# Altium schematic sheet Droneport_with_STM32.SchDoc
size A2; SheetNumber: 1; SheetTotal: 1
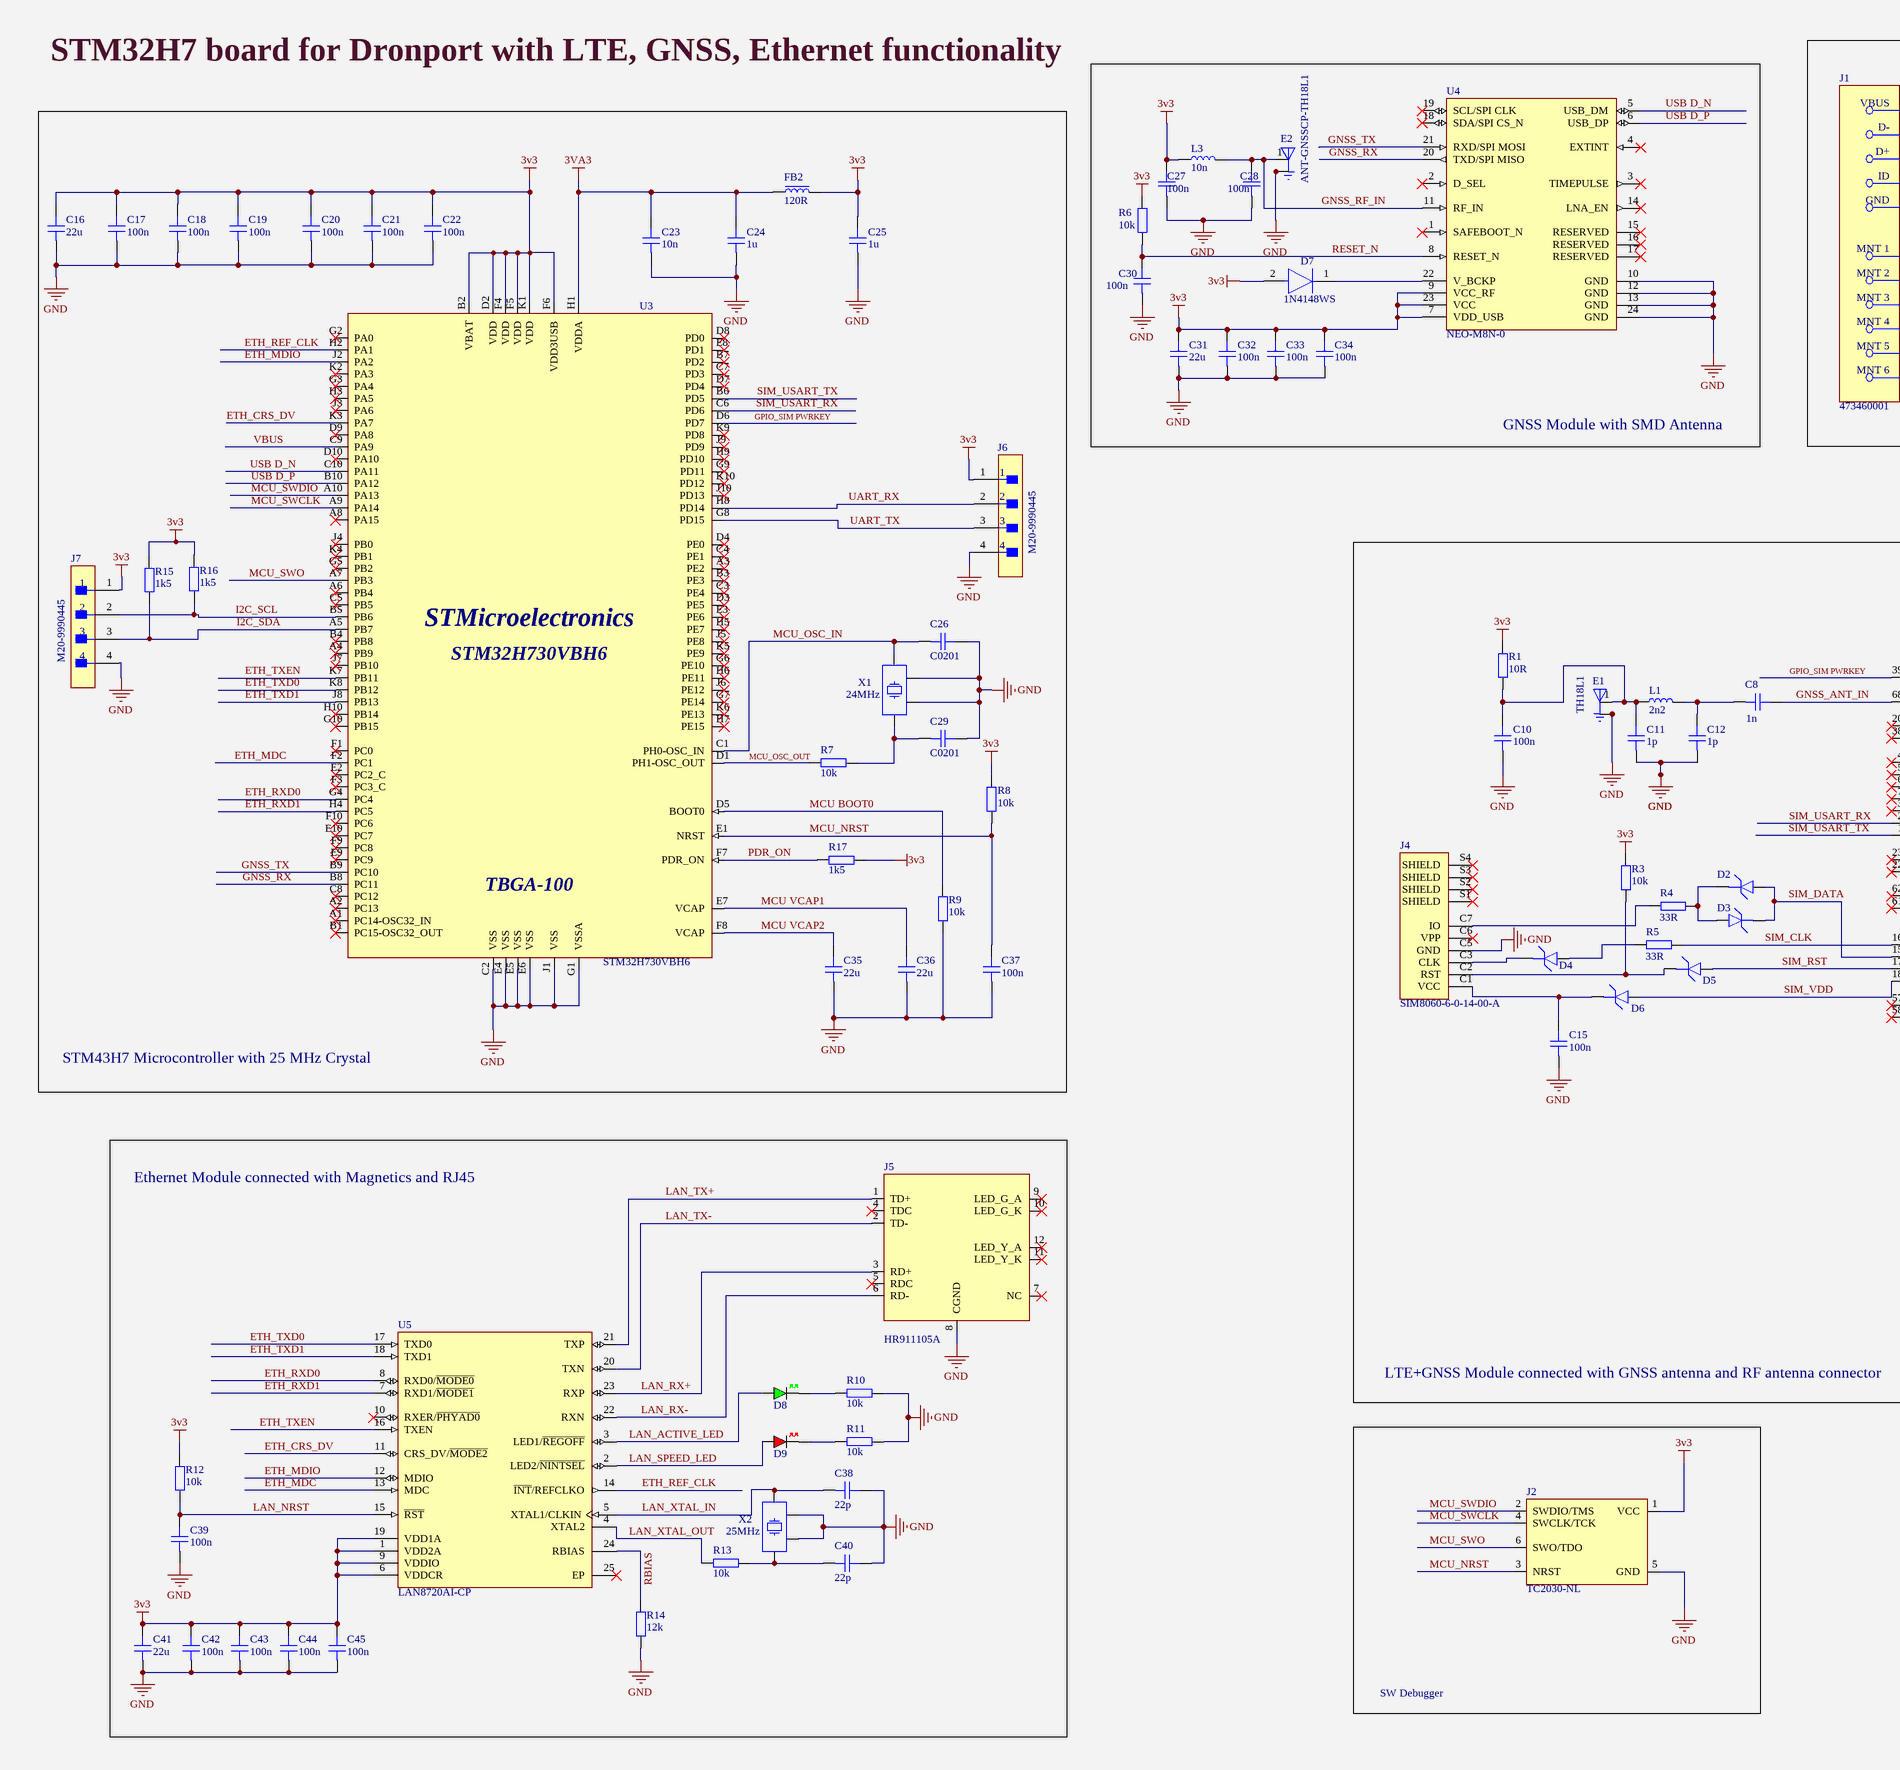
[diagram p0: Droneport_with_STM32.SchDoc, left]
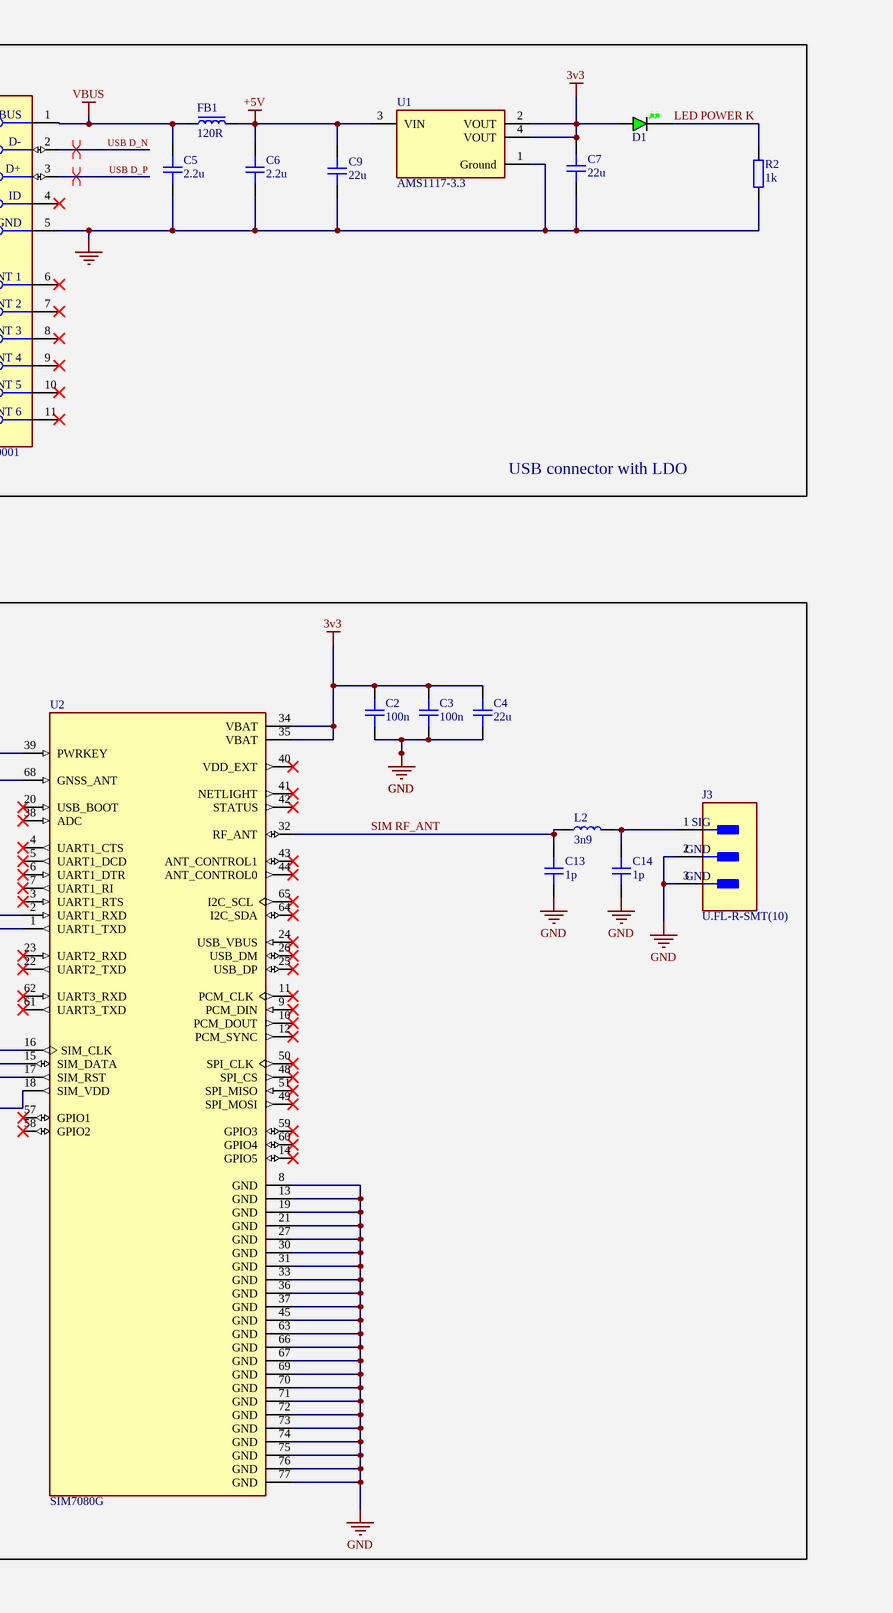
[diagram p1: Droneport_with_STM32.SchDoc, right]

## Parts
C2  100n  [CAP_0402]
C3  100n  [CAP_0402]
C4  22u  [CAP_0603]
C5  2.2u  [CAP_0603]
C6  2.2u  [CAP_0603]
C7  22u  [CAP_0805]
C8  1n  [CAP_0402]
C9  22u  [CAP_0805]
C10  100n  [CAP_0402]
C11  1p  [CAP_0402]
C12  1p  [CAP_0402]
C13  1p  [CAP_0402]
C14  1p  [CAP_0402]
C15  100n  [CAP_0402]
C16  22u  [CAP_0603]
C17  100n  [CAP_0402]
C18  100n  [CAP_0402]
C19  100n  [CAP_0402]
C20  100n  [CAP_0402]
C21  100n  [CAP_0402]
C22  100n  [CAP_0402]
C23  10n  [CAP_0402]
C24  1u  [CAP_0402]
C25  1u  [CAP_0402]
C26  C0201  [CAP_0201]
C27  100n  [CAP_0402]
C28  100n  [CAP_0402]
C29  C0201  [CAP_0201]
C30  100n  [CAP_0402]
C31  22u  [CAP_0603]
C32  100n  [CAP_0402]
C33  100n  [CAP_0402]
C34  100n  [CAP_0402]
C35  22u  [CAP_0805]
C36  22u  [CAP_0805]
C37  100n  [CAP_0402]
C38  22p  [CAP_0402]
C39  100n  [CAP_0402]
C40  22p  [CAP_0402]
C41  22u  [CAP_0603]
C42  100n  [CAP_0402]
C43  100n  [CAP_0402]
C44  100n  [CAP_0402]
C45  100n  [CAP_0402]
D1  GREEN  [LED_0402_GREEN]  (value not drawn)
D2  TVS_DATA  [D_0402]  (value not drawn)
D3  TVS_DATA  [D_0402]  (value not drawn)
D4  TVS_CLK  [D_0402]  (value not drawn)
D5  TVS_RST  [D_0402]  (value not drawn)
D6  TVS_VDD  [D_0402]  (value not drawn)
D7  1N4148WS  [FP-477AB-IPC_C]
D8  GREEN  [LED_0402_GREEN]  (value not drawn)
D9  RED  [LED_0402_RED]  (value not drawn)
E1  TH18L1  [XCVR_ANT-GNSSCP-TH18L1]
E2  ANT-GNSSCP-TH18L1  [XCVR_ANT-GNSSCP-TH18L1]
FB1  120R  [FB_0603]
FB2  120R  [FB_0603]
J1  473460001  [FP-473460001-MFG]
J2  TC2030-NL  [TC2030-NL-FP]  (no BOM)
J3  U.FL-R-SMT(10)  [FP-U_FL-R-SMT_10-MFG]
J4  SIM8060-6-0-14-00-A  [GCT_SIM8060-6-0-14-00-A]
J5  HR911105A  [HR911105A]
J6  M20-9990445  [FP-M20-9990445-MFG]
J7  M20-9990445  [FP-M20-9990445-MFG]
L1  2n2  [IND_0402]
L2  3n9  [IND_0402]
L3  10n  [IND_0603]
R1  10R  [RES_0402]
R2  1k  [RES_0402]
R3  10k  [RES_0402]
R4  33R  [RES_0402]
R5  33R  [RES_0402]
R6  10k  [RES_0402]
R7  10k  [RES_0603]
R8  10k  [RES_0603]
R9  10k  [RES_0603]
R10  10k  [RES_0402]
R11  10k  [RES_0402]
R12  10k  [RES_0402]
R13  10k  [RES_0402]
R14  12k  [RES_0402]
R15  1k5  [RES_0603]
R16  1k5  [RES_0603]
R17  1k5  [RES_0603]
U1  AMS1117-3.3  [FP-AMS1117-IPC_C]
U2  SIM7080G  [XCVR_SIM7080G]
U3  STM32H730VBH6  [TFBGA100_8X8_STM]
U4  NEO-M8N-0  [UBX-NEO-M8-24_V]
U5  LAN8720AI-CP  [MCHP-QFN-24_V]
X1  24MHz  [XTAL_3225]
X2  25MHz  [XTAL_3225]

## Blocks framed on the sheet
USB connector with LDO: C5-C7 C9 D1 FB1 J1 R2 U1
GNSS Module with SMD Antenna: C27 C28 C30-C34 D7 E2 L3 R6 U4
STM43H7 Microcontroller with 25 MHz Crystal: C16-C26 C29 C35-C37 FB2 J6 J7 R7-R9 R15-R17 U3 X1
Ethernet Module connected with Magnetics and RJ45: C38-C45 D8 D9 J5 R10-R14 U5 X2
SW Debugger: J2

## Nets
3v3: C2.2 C3.2 C4.2 C7.2 C16.2 C17.2 C18.2 C19.2 C20.2 C21.2 C22.2 C25.2 C27.2 C31.2 C32.2 C33.2 C34.2 C41.2 C42.2 C43.2 C44.2 C45.2 D1.A D7.2(A) FB2.2 J2.1(VCC) J6.1 J7.1 L3.1 R1.2 R3.2 R6.2 R8.2 R12.1 R15.2 R16.2 R17.1 U1.2(VOUT) U1.4(VOUT) U2.34(VBAT) U2.35(VBAT) U3.B2(VBAT) U3.D2(VDD) U3.F4(VDD) U3.F5(VDD) U3.F6(VDD3USB) U3.K1(VDD) U4.7(VDD_USB) U4.9(VCC_RF) U4.23(VCC) U5.1(VDD2A) U5.6(VDDCR) U5.9(VDDIO) U5.19(VDD1A)
3VA3: C23.2 C24.2 FB2.1 U3.H1(VDDA)
+5V: C6.2 C9.2 FB1.2 U1.3(VIN)
GND: C2.1 C3.1 C4.1 C5.1 C6.1 C7.1 C9.1 C10.1 C11.1 C12.1 C13.1 C14.1 C15.1 C16.1 C17.1 C18.1 C19.1 C20.1 C21.1 C22.1 C23.1 C24.1 C25.1 C26.2 C27.1 C28.1 C29.2 C30.1 C31.1 C32.1 C33.1 C34.1 C35.1 C36.1 C37.1 C38.2 C39.1 C40.2 C41.1 C42.1 C43.1 C44.1 C45.1 E1.2(GND) E1.3(GND) E1.4(GND) E1.5(GND) E2.2(GND) E2.3(GND) E2.4(GND) E2.5(GND) J1.5(GND) J2.5(GND) J3.2(GND) J3.3(GND) J4.C5(GND) J5.8(CGND) J6.4 J7.4 R2.1 R9.1 R10.2 R11.2 R14.1 U1.1(Ground) U2.8(GND) U2.13(GND) U2.19(GND) U2.21(GND) U2.27(GND) U2.30(GND) U2.31(GND) U2.33(GND) U2.36(GND) U2.37(GND) U2.45(GND) U2.63(GND) U2.66(GND) U2.67(GND) U2.69(GND) U2.70(GND) U2.71(GND) U2.72(GND) U2.73(GND) U2.74(GND) U2.75(GND) U2.76(GND) U2.77(GND) U3.C2(VSS) U3.E4(VSS) U3.E5(VSS) U3.E6(VSS) U3.G1(VSSA) U3.J1(VSS) U4.10(GND) U4.12(GND) U4.13(GND) U4.24(GND) X1.2 X1.4 X2.2 X2.4
VBUS: C5.2 FB1.1 J1.1(VBUS) U3.C9(PA9)
ETH_CRS_DV: U3.K3(PA7) U5.11(CRS_DV/~{MODE2})
ETH_MDC: U3.F2(PC1) U5.13(MDC)
ETH_MDIO: U3.J2(PA2) U5.12(MDIO)
ETH_REF_CLK: U3.H2(PA1) U5.14(~{INT}/REFCLKO)
ETH_RXD0: U3.G4(PC4) U5.8(RXD0/~{MODE0})
ETH_RXD1: U3.H4(PC5) U5.7(RXD1/~{MODE1})
ETH_TXD0: U3.K8(PB12) U5.17(TXD0)
ETH_TXD1: U3.J8(PB13) U5.18(TXD1)
ETH_TXEN: U3.K7(PB11) U5.16(TXEN)
GNSS_ANT_IN: C8.2 U2.68(GNSS_ANT)
GNSS_RF_IN: C28.2 E2.1(FEED) L3.2 U4.11(RF_IN)
GNSS_RX: U3.B8(PC11) U4.20(TXD/SPI_MISO)
GNSS_TX: U3.B9(PC10) U4.21(RXD/SPI_MOSI)
GPIO_SIM PWRKEY: U2.39(PWRKEY) U3.D6(PD7)
I2C_SCL: J7.2 R16.1 U3.B5(PB6)
I2C_SDA: J7.3 R15.1 U3.A5(PB7)
LAN_ACTIVE_LED: D8.A U5.3(LED1/~{REGOFF})
LAN_NRST: C39.2 R12.2 U5.15(~{RST})
LAN_RX+: J5.3(RD+) U5.23(RXP)
LAN_RX-: J5.6(RD-) U5.22(RXN)
LAN_SPEED_LED: D9.A U5.2(LED2/~{NINTSEL})
LAN_TX+: J5.1(TD+) U5.21(TXP)
LAN_TX-: J5.2(TD-) U5.20(TXN)
LAN_XTAL_IN: C38.1 U5.5(XTAL1/CLKIN) X2.3
LAN_XTAL_OUT: R13.2 U5.4(XTAL2)
LED POWER K: D1.K R2.2
MCU BOOT0: R9.2 U3.D5(BOOT0)
MCU VCAP1: C36.2 U3.E7(VCAP)
MCU VCAP2: C35.2 U3.F8(VCAP)
MCU_NRST: C37.2 J2.3(NRST) R8.1 U3.E1(NRST)
MCU_OSC_IN: C26.1 U3.C1(PH0-OSC_IN) X1.3
MCU_OSC_OUT: R7.2 U3.D1(PH1-OSC_OUT)
MCU_SWCLK: J2.4(SWCLK/TCK) U3.A9(PA14)
MCU_SWDIO: J2.2(SWDIO/TMS) U3.A10(PA13)
MCU_SWO: J2.6(SWO/TDO) U3.A7(PB3)
PDR_ON: R17.2 U3.F7(PDR_ON)
RBIAS: R14.2 U5.24(RBIAS)
RESET_N: C30.2 R6.1 U4.8(RESET_N)
SIM RF_ANT: C13.2 L2.1 U2.32(RF_ANT)
SIM_CLK: R5.1 U2.16(SIM_CLK)
SIM_DATA: D2.A D3.K U2.15(SIM_DATA)
SIM_RST: D5.A U2.17(SIM_RST)
SIM_USART_RX: U2.2(UART1_RXD) U3.C6(PD6)
SIM_USART_TX: U2.1(UART1_TXD) U3.B6(PD5)
SIM_VDD: D6.A U2.18(SIM_VDD)
UART_RX: J6.2 U3.H8(PD14)
UART_TX: J6.3 U3.G8(PD15)
USB D_N: J1.2(D-) U3.C10(PA11) U4.5(USB_DM)
USB D_P: J1.3(D+) U3.B10(PA12) U4.6(USB_DP)
NetC8_1: C8.1 C12.2 L1.2
NetC10_2: C10.2 C11.2 E1.1(FEED) L1.1 R1.1
NetC14_2: C14.2 J3.1(SIG) L2.2
NetC15_2: C15.2 D6.K J4.C1(VCC)
NetC29_1: C29.1 R7.1 X1.1
NetC40_1: C40.1 R13.1 X2.1
NetD2_K: D2.K D3.A R4.1
NetD4_A: D4.A R5.2
NetD4_K: D4.K J4.C3(CLK)
NetD5_K: D5.K J4.C2(RST) R3.1
NetD7_1: D7.1(C) U4.22(V_BCKP)
NetD8_K: D8.K R10.1
NetD9_K: D9.K R11.1
NetJ4_C7: J4.C7(IO) R4.2

Not connected (* = marked no-connect by the designer): J1 4(ID)* 6(MNT_1)* 7(MNT_2)* 8(MNT_3)* 9(MNT_4)* 10(MNT_5)* 11(MNT_6)*; J4 C6(VPP)* S1(SHIELD)* S2(SHIELD)* S3(SHIELD)* S4(SHIELD)*; J5 4(TDC)* 5(RDC)* 7(NC)* 9(LED_G_A)* 10(LED_G_K)* 11(LED_Y_K)* 12(LED_Y_A)*; U2 3(UART1_RTS)* 4(UART1_CTS)* 5(UART1_DCD)* 6(UART1_DTR)* 7(UART1_RI)* 9(PCM_DIN)* 10(PCM_DOUT)* 11(PCM_CLK)* 12(PCM_SYNC)* 14(GPIO5)* 20(USB_BOOT)* 22(UART2_TXD)* 23(UART2_RXD)* 24(USB_VBUS)* 25(USB_DP)* 26(USB_DM)* 38(ADC)* 40(VDD_EXT)* 41(NETLIGHT)* 42(STATUS)* 43(ANT_CONTROL1)* 44(ANT_CONTROL0)* 48(SPI_CS)* 49(SPI_MOSI)* 50(SPI_CLK)* 51(SPI_MISO)* 57(GPIO1)* 58(GPIO2)* 59(GPIO3)* 60(GPIO4)* 61(UART3_TXD)* 62(UART3_RXD)* 64(I2C_SDA)* 65(I2C_SCL)*; U3 A1(PC14-OSC32_IN)* A2(PC13)* A3(PE2)* A4(PB9)* A6(PB4)* A8(PA15)* B1(PC15-OSC32_OUT)* B3(PE3)* B4(PB8)* B7(PD2)* C3(PE4)* C4(PE1)* C5(PB5)* C7(PD3)* C8(PC12)* D3(PE5)* D4(PE0)* D7(PD4)* D8(PD0)* D9(PA8)* D10(PA10)* E2(PC2_C)* E3(PE6)* E8(PD1)* E9(PC9)* E10(PC7)* F1(PC0)* F3(PC3_C)* F9(PC8)* F10(PC6)* G2(PA0)* G3(PA4)* G5(PB2)* G6(PE10)* G7(PE14)* G9(PD11)* G10(PB15)* H3(PA5)* H5(PE7)* H6(PE11)* H7(PE15)* H9(PD10)* H10(PB14)* J3(PA6)* J4(PB0)* J5(PE8)* J6(PE12)* J7(PB10)* J9(PD9)* J10(PD13)* K2(PA3)* K4(PB1)* K5(PE9)* K6(PE13)* K9(PD8)* K10(PD12)*; U4 1(SAFEBOOT_N)* 2(D_SEL)* 3(TIMEPULSE)* 4(EXTINT)* 14(LNA_EN)* 15(RESERVED)* 16(RESERVED)* 17(RESERVED)* 18(SDA/SPI_CS_N)* 19(SCL/SPI_CLK)*; U5 10(RXER/~{PHYAD0})* 25(EP)*

## Layout directives
differential pair: USB D_N, USB D_P

## Notes on the sheet
- STM32H7 board for Dronport with LTE, GNSS, Ethernet functionality
- (near U2) LTE+GNSS Module connected with GNSS antenna and RF antenna connector
- (in symbol STM32H730VBH6) TBGA-100

## Library data of the parts
C2 C3 C8 C10-C15 C17-C25 C27 C28 C30 C32-C34 C37-C40 C42-C45 = CAP_0402: Capacitor SMD 0402; Manufacturer: *; Manufacturer Part Number: *; Distributor Link: *; LCSC: *; Rating: *; Dielectric: *
C4-C6 C16 C31 C41 = CAP_0603: Capacitor SMD 0603; Manufacturer: *; Manufacturer Part Number: *; Distributor Link: *; LCSC: *; Rating: *; Dielectric: *
C7 C9 C35 C36 = CAP_0805: Capacitor SMD 0805; Manufacturer: *; Manufacturer Part Number: *; Distributor Link: *; LCSC: *; Rating: *; Dielectric: *
C26 C29 = CAP_0201: Capacitor SMD 0201; Manufacturer: *; Manufacturer Part Number: *; Distributor Link: *; LCSC: *; Rating: *; Dielectric: *
D1 D8 = LED_0402_GREEN: LED 0402 GREEN SMD
D2-D6 = D_TVS_0402: Diode TVS / ESD 0402
D7 = CMP-07163-000040-1: DIODE GEN PURP 75V 150MA SOD323F; Forward Voltage: 1V; Power Dissipation: 200mW; Element Configuration: Single; Max Forward Surge Current (Ifsm): 2A; Peak Reverse Current: 5uA; Recovery Time: 4ns; Package Quantity: 1; Number of Pins: 2; Height: 1mm; REACH SVHC: No SVHC; Max Reverse Voltage (DC): 75V; Forward Current: 150mA; Length: 1.8mm; Max Repetitive Reverse Voltage (Vrrm): 75V; Max Operating Temperature: 150°C; Average Rectified Current: 150mA; Contact Plating: Tin; Packaging: Tape and Reel; Radiation Hardening: No; Min Operating Temperature: -55°C; Width: 1.35mm; Weight: 0.0276g; Lead Free: Lead Free; Mount: Surface Mount; Reverse Voltage: 75V; Reverse Recovery Time: 4ns
D9 = LED_0402_RED: LED 0402 RED SMD
E1 = ANT-GNSSCP-TH18L1: Package: None; Price: None; Value: *; MP: ANT-GNSSCP-TH18L1; Availability: Unavailable
FB1 FB2 = FB_0603: Ferrite Bead SMD 0603; Manufacturer: *; Manufacturer Part Number: *; Distributor Link: *; LCSC: *
J1 = CMP-2000-05246-2: CONN RCPT USB2.0 MICRO B SMD R/A; Manufacturer: Molex; Conn Orientation: Right Angle; Is Female: yes; Shielding: true; Pitch: 0.65mm; Number Of Contacts: 5; Voltage Rating: 30V; Current Rating: 1.8A; Device Class L2: USB Connectors; Digikey Description: CONN RCPT USB2.0 MICRO B SMD R/A; Height: 2.945mm; RoHS: TRUE; ComponentLink2Description: Datasheet; Octopart: https://octopart.com/47346-0001-molex-7164928; Automotive: No; Package: 0; Category: Conn; Device Class L1: Connectors; Usb Standard: USB 2.0; Temperature: -30°C to +85°C; Temperature Range Low: -30°C; Footprint Url: https://www.molex.com/pdm_docs/sd/473460001_sd.pdf; ComponentLink2URL: https://www.molex.com/webdocs/datasheets/pdf/en-us/0473460001_IO_CONNECTORS.pdf; Lead Free: Yes; Manufacturer Part Number: 473460001; Contact Material: Gold,Nickel; Temperature Range High: +85°C; Device Class L3: unset
J2 = TC2030-NL: Tag-Connect No-Solder SWD Debug Connector (No Legs) DO NOT PLACE; Manufacturer: Tag-Connect; Manufacturer Part Number: TC2030-NL-FP
J3 = CMP-0029-00003-2: CONN U.FL RCPT STR 50 OHM SMD; Plating: Silver; Connector Type: Coaxial; Frequency: 6GHz; Impedance: 50R; Body Material: Bronze; Dielectric Material: Polymer; Contact Plating: Gold; Termination: Solder; Orientation: Vertical; Contact Material: Brass; Min Operating Temperature: -40°C; Mount: Surface Mount; Lead Free: Lead Free; Max Operating Temperature: 90°C; Radiation Hardening: No; Packaging: Tape and Reel; Body Plating: Silver; Fastening Type: Snap; Max Frequency: 6GHz; Depth: 3.1mm; Package Quantity: 1; Case/Package: SMD/SMT; Housing Color: Beige; Length: 3mm
J4 = SIM8060-6-0-14-00-A: 6 Position Card Connector NANO SIM Surface Mount, Right Angle Gold; MF: Global Connector Technology; MP: SIM8060-6-0-14-00-A; Package: Package Analog Devices; Price: None; Availability: Unavailable; SnapEDA_Link: https://www.snapeda.com/parts/SIM8060-6-0-14-00-A/Global%20Connector%20Technology/view-part/3214904/?ref=snap; Value: *
J5 = HR911105A: Single Port RJ45 Connector w/ Integrated Magnetic and LED 10/100 Base-T; Manufacturer: HanRun; Manufacturer Part Number: HR911105A
J6 J7 = CMP-00671-05399696-1: M20-9990445 Conn Unshrouded Header HDR 4 POS 2.54mm Solder ST Thru-Hole Bulk/Loose; Insulation Resistance: 10GΩ; Connector Type: Male Pin; Voltage Rating (DC): 750V; Max Current Rating: 3A; Contact Resistance: 25mΩ; Number of Contacts: 4; Gender: Male; Color: Black; Height: 2.54mm; Contact Material: Brass, Bronze, Gold, Nickel; Orientation: Straight; Width: 12.7mm; Mount: Through Hole; Pitch: 2.54mm; Lead Pitch: 2.54mm; RoHS: Compliant; Max Operating Temperature: 105°C; Case/Package: SIL; NexarPartId: 5399696; Depth: 2.54mm; Length: 10.16mm; Current Rating: 3A; Contact Plating: Gold; Radiation Hardening: No; Contact Mating Length: 6.096mm; Voltage Rating (AC): 750V; Termination: Solder; REACH SVHC: No SVHC; Weight: 45.359237g; Number of Rows: 1; Min Operating Temperature: -40°C; Housing Material: Nylon; Housing Color: Black; Number of Positions: 4; Number of Pins: 4
L1 L2 = IND_0402: Inductor SMD 0402
L3 = IND_0603: Inductor SMD 0603
R1-R6 R10-R14 = RES_0402: Resistor SMD 0402; Manufacturer: *; Manufacturer Part Number: *; Distributor Link: *; LCSC: *
R7-R9 R15-R17 = RES_0603: Resistor SMD 0603; Manufacturer: *; Manufacturer Part Number: *; Distributor Link: *; LCSC: *
U1 = CMP-209535-000001-1: LDO Voltage Regulators 1A, 3.3V; Manufacturer: Advanced Monolithic Systems; Dropout Voltage: 1.1V; Output Type: Fixed; Nominal Supply Current: 5mA; Max Power Dissipation: 1.2W; Max Supply Voltage: 15V; Number Of Outputs: 1; Standoff Height: 0.64mm; Max Junction Temp: +125°C; Height: 1.8mm; Package: AMS1117; Device Class L2: Power Management ICs; ComponentLink2Description: Datasheet; ComponentLink2URL: http://www.advanced-monolithic.com/pdf/ds1117.pdf; Category: IC; RoHS: TRUE; Automotive: No; Device Class L1: Integrated Circuits (ICs); Output Current: 1A; Device Class L3: Voltage Regulators - Linear; Temperature: -40°C to +125°C; Output Voltage: 3.3V; Manufacturer Part Number: AMS1117-3.3; Temperature Range Low: -40°C; Octopart: https://octopart.com/ams1117-3.3-advanced+monolithic+systems-25899300; Lead Free: Yes; Ipc Land Pattern Name: SOT229P700X180-4; Temperature Range High: +125°C
U2 = SIM7080G: Cellular, Navigation Galileo, GLONASS, GPS, GNSS, LTE Transceiver Module 1.559GHz ~ 1.576GHz, 1.575GHz ~ 1.576GHz, 1.574GHz ~ 1.606GHz, 1.598GHz ~ 1.563GHz Antenna Not Included Surface Mount; MF: SIMCom; SnapEDA_Link: https://www.snapeda.com/parts/SIM7080G/SIMCom/view-part/?ref=snap; Package: Package; Value: *; MP: SIM7080G; Check_prices: https://www.snapeda.com/parts/SIM7080G/SIMCom/view-part/?ref=eda
U3 = STM32H730VBH6: 32-bit Arm® Cortex®-M7 550 MHz MCU, 128 KB Flash, 564 KB RAM, 35 comms peripherals and analog interfaces, TFBGA-100; Manufacturer: STMicroelectronics; Manufacturer Part Number: STM32H730VBH6
U4 = CMP-2000-07559-1: U-Blox M8 Concurrent Gnss Module, 3.6 V, -40 to 85 degC, 24-Pin SMD, RoHS, Tape and Reel; Mounting Technology: SurfaceMount; Manufacturer: U-Blox; Manufacturer URL: https://www.u-blox.com/en; Package Reference: NEO-M8N-0; Datasheet Version: Rev. R03, 08/2016; RoHSCompliant: False; Package URL: https://www.u-blox.com/sites/default/files/NEO-8Q-NEO-M8-FW3_HardwareIntegrationManual_%28UBX-15029985%29.pdf; Datasheet URL: https://www.u-blox.com/sites/default/files/NEO-M8-FW3_DataSheet_%28UBX-15031086%29.pdf; Package Description: 24-Pin Surface Mount Device, Body 16 x 12.2 mm, Pitch 1.1 mm
U5 = CMP-2000-05216-1: RMII 10/100 Ethernet Transceiver with HP Auto-MDIX Support, -40 to 85 degC, 24-Pin QFN, RoHS, Tray; Manufacturer: Microchip; Number of Drivers/Receivers: 4/4; Other Names: 638-1084; Dynamic Catalog: PhysicalLayerTransceiver; Voltage - Supply: 1.6V~3.6V; Package Reference: QFN-24; Series: -; Protocol: RMII; Packaging: Tray; Datasheet URL: http://ww1.microchip.com/downloads/en/DeviceDoc/8720a.pdf; Package Description: 24-Pin Quad Flat No-lead Package, Body 4 x 4 mm, Pitch 0.5 mm; Mounting Type: SurfaceMount; Package / Case: 24-VFQFNExposedPad; Category: IntegratedCircuits(ICs); Family: Interface-Drivers,Receivers,Transceivers; Type: Transceiver; Supplier Device Package: 24-QFN(4x4); Manufacturer URL: http://www.microchip.com/; Datasheet Version: Rev. 1.4, 08/2012; Standard Package: 490
X1 X2 = TSX-3225_24.0000MF15X-AC: Crystal SMD 24MHz 10PPM 7pF 3225; Manufacturer: Epson; Manufacturer Part Number: TSX-3225 24.0000MF15X-AC
E2 = ANT-GNSSCP-TH18L1: Package: None; Price: None; Value: *; MP: ANT-GNSSCP-TH18L1; Availability: Unavailable